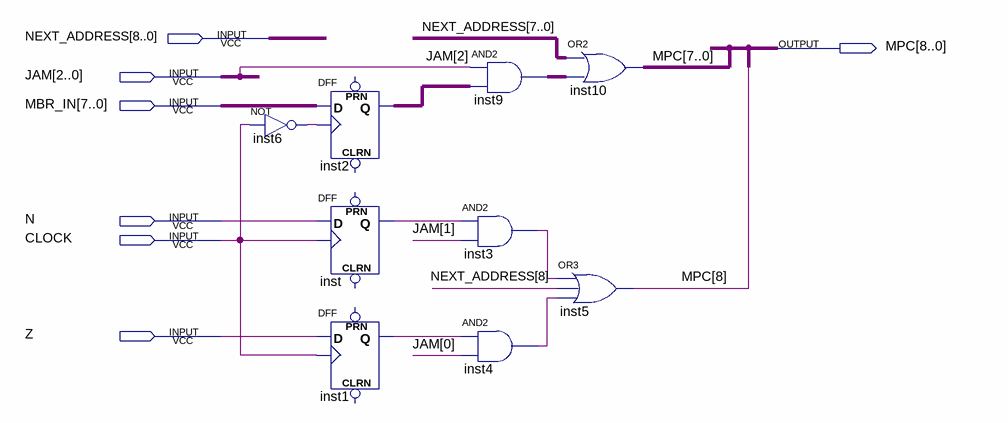
[diagram p0: schematic sheet]
// Quartus schematic mpc_generator.bdf as structural Verilog: 9 symbols, 7 pins
module mpc_generator (
  input  [8:0] NEXT_ADDRESS,
  input  [2:0] JAM,
  input  [7:0] MBR_IN,
  input  N,
  input  CLOCK,
  input  Z,
  output [8:0] MPC
);

  wire inst1_q, inst3_out, inst4_out, inst6_out, inst_q;
  wire [7:0] inst2_q, inst9_out;

  not inst6 (inst6_out, CLOCK);
  DFF inst2[7:0] (.CLK(inst6_out), .D(MBR_IN), .Q(inst2_q));  // open: CLRN, PRN
  DFF inst (.CLK(CLOCK), .D(N), .Q(inst_q));  // open: CLRN, PRN
  DFF inst1 (.CLK(CLOCK), .D(Z), .Q(inst1_q));  // open: CLRN, PRN
  and inst3 (inst3_out, inst_q, JAM[1]);
  and inst4 (inst4_out, inst1_q, JAM[0]);
  assign inst9_out = {8{JAM[2]}} & inst2_q;  // AND2 inst9, 8 bits wide
  assign MPC[7:0] = NEXT_ADDRESS[7:0] | inst9_out;  // OR2 inst10, 8 bits wide
  or inst5 (MPC[8], inst3_out, NEXT_ADDRESS[8], inst4_out);
endmodule
